# Altium project B302.PrjPcb (part 2 of 2)

## Sheet Sense 7 Signal Isolation.SchDoc: Signal 7 Isolator
size 292 x 193 mm; SheetNumber: 9; SheetTotal: 11
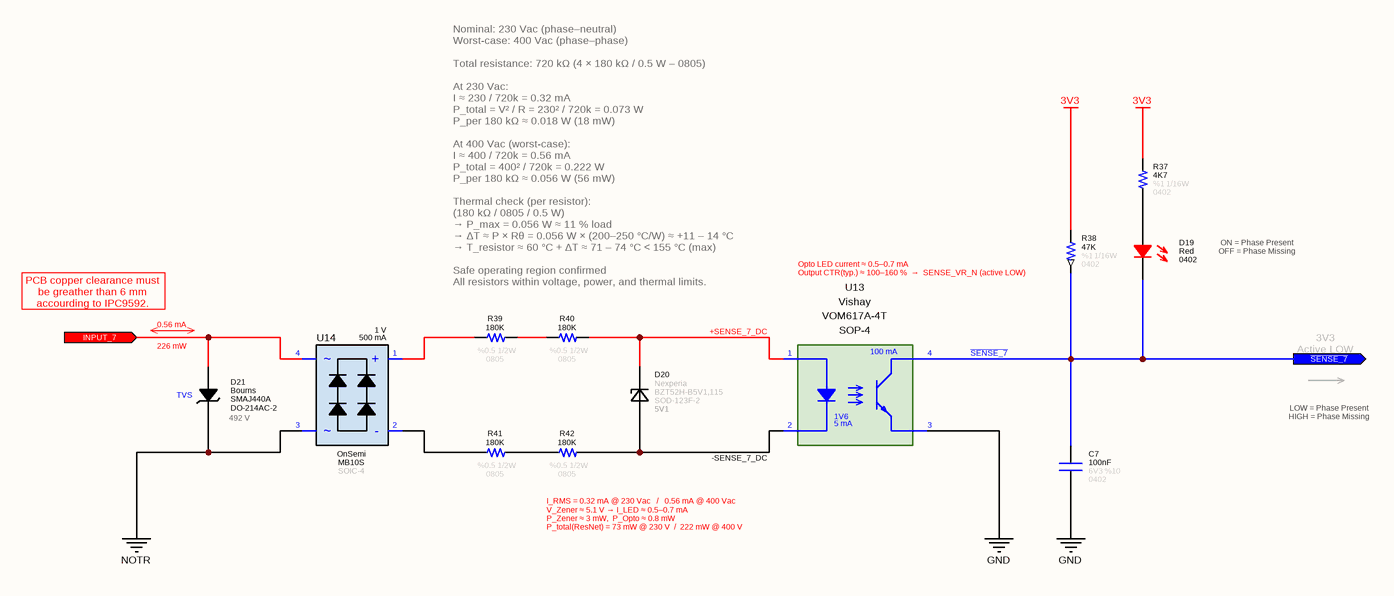
[diagram p8: Sense 7 Signal Isolation.SchDoc]

### Parts
C7  value 100nF  Tolerance: %10  Voltage: 6V3  Case: 0402  [CAPACITOR_0402]  (hidden comment: Capacitor - 100nF [0402] (MLCC))
D19  Case: 0402  Color: Red  [LED_0402]  (hidden comment: SMD LED (Red))
D20  Zener Voltage: 5V1  Manufacturer Name: Nexperia  [SOD-123F-2]  (hidden comment: BZT52H-B5V1,115)
D21  BreakDown Voltage: 492 V  Manufacturer Name: Bourns  Case: DO-214AC-2  [DO-220AA-2]  (hidden comment: SMAJ440A)
R37  value 4K7  Tolerance: %1  Case: 0402  Power: 1/16W  [RESISTOR_0402]  (hidden comment: 4K7 - 0402 - %1 - 1/16W)
R38  value 47K  Tolerance: %1  Case: 0402  Power: 1/16W  [RESISTOR_0402]  (hidden comment: 47K - 0402 - %1 - 1/16W)
R39  value 180K  Tolerance: %0.5  Case: 0805  Power: 1/2W  [RESISTOR_0805]  (hidden comment: 180K - 0805 - %0.5 - 1/2W)
R40  value 180K  Tolerance: %0.5  Case: 0805  Power: 1/2W  [RESISTOR_0805]  (hidden comment: 180K - 0805 - %0.5 - 1/2W)
R41  value 180K  Tolerance: %0.5  Case: 0805  Power: 1/2W  [RESISTOR_0805]  (hidden comment: 180K - 0805 - %0.5 - 1/2W)
R42  value 180K  Tolerance: %0.5  Case: 0805  Power: 1/2W  [RESISTOR_0805]  (hidden comment: 180K - 0805 - %0.5 - 1/2W)
U13  Manufacturer Name: Vishay  Case: SOP-4  If - Forward Current: 5 mA  Vf - Forward Voltage: 1V6  Maximum Collector Current: 100 mA  [SOP-4V2]  (hidden comment: VOM617A-4T)
U14  If - Forward Current: 500 mA  Vf - Forward Voltage: 1 V  Manufacturer Name: OnSemi  Manufacturer Part Number: MB10S  [SOIC-4]  (hidden comment: LTV-846S)

### Ports
INPUT_7 (in), ~{SENSE_7} (out)

### Nets
3V3: R37.2 R38.2
GND: C7.1 U13.3(Emiter)
NOTR: D21.2(Cathode) U14.3
+SENSE_7_DC: D20.1(Cathode) R40.1 U13.1(LED_Anode)
-SENSE_7_DC: D20.2(Anode) R42.1 U13.2(LED_Cathode)
~{SENSE_7}: C7.2 D19.1 R38.1 U13.4(Collector) ; port ~{SENSE_7}
NetD19_2: D19.2 R37.1
NetD21_1: D21.1(Anode) U14.4 ; port INPUT_7
NetR39_1: R39.1 R40.2
NetR39_2: R39.2 U14.1(+)
NetR41_1: R41.1 R42.2
NetR41_2: R41.2 U14.2(-)

### Notes on the sheet
- (near R38) Opto LED current ≈ 0.5–0.7 mA
  Output CTR(typ.) ≈ 100–160 %  →  SENSE_VR_N (active LOW)
- ON = Phase Present
  OFF = Phase Missing
- PCB copper clearance must be greather than 6 mm accourding to IPC9592.
- 0.56 mA
- (near D21) 226 mW
- Nominal: 230 Vac (phase–neutral)
  Worst-case: 400 Vac (phase–phase)
  Total resistance: 720 kΩ (4 × 180 kΩ / 0.5 W – 0805)
  At 230 Vac:
  I ≈ 230 / 720k = 0.32 mA
  P_total = V² / R = 230² / 720k = 0.073 W
  P_per 180 kΩ ≈ 0.018 W (18 mW)
  At 400 Vac (worst-case):
  I ≈ 400 / 720k = 0.56 mA
  P_total = 400² / 720k = 0.222 W
  P_per 180 kΩ ≈ 0.056 W (56 mW)
  Thermal check (per resistor):
  (180 kΩ / 0805 / 0.5 W)
  → P_max = 0.056 W ≈ 11 % load
  → ΔT ≈ P × Rθ = 0.056 W × (200–250 °C/W) ≈ +11 – 14 °C
  → T_resistor ≈ 60 °C + ΔT ≈ 71 – 74 °C < 155 °C (max)
  Safe operating region confirmed
  All resistors within voltage, power, and thermal limits.
- 3V3
  Active LOW
- LOW = Phase Present
  HIGH = Phase Missing
- I_RMS = 0.32 mA @ 230 Vac   /   0.56 mA @ 400 Vac
  V_Zener ≈ 5.1 V → I_LED ≈ 0.5–0.7 mA
  P_Zener ≈ 3 mW,  P_Opto ≈ 0.8 mW
  P_total(ResNet) = 73 mW @ 230 V  /  222 mW @ 400 V
- © 2021 All rights reserved.
  This document may not, in whole or in part, be copied, photocopied, reproduced, translated or converted to any electronic or machine readable from without prior written permission of Mehmet Günce Akkoyun.
  Engineer contact : akkoyun@me.com
- Property of
- Engineer :
- Date :
- Size :
- A4
- Time :
- Project :
- Page :
- /
- Customer :
- Product ID :
- Module ID :
- Version :
- File :
- Revision :
- (in symbol Diode - SMAJ440A (TVS)) TVS

### Library data of the parts
C7 = Capacitor - 100nF [0402-6V3]: Capacitor (MLCC) - 100nF / 6V3 / 0402; Manufacturer Name: KYOCERA AVX; Manufacturer Part Number: 04026D104KAT4A; ComponentLink1Description: Mouser; ComponentLink1URL: https://www.mouser.com.tr/ProductDetail/AVX/04026D104KAT4A?qs=sGAEpiMZZMs0AnBnWHyRQPg4iYkCw7IMED%2F4kpqgf7w%3D; ComponentLink2Description: DataSheet; ComponentLink2URL: https://www.mouser.com.tr/datasheet/2/40/cx5r-776519.pdf; Subcategory: Capacitors
D19 = Diode - LED (0402-Red): Standard LEDs - SMD MINI-MOLD ULTRA COMPACT RED; Manufacturer Name: ROHM Semiconductor; Manufacturer Part Number: SML-P12VTT86R; ROHS: Yes; ComponentLink1Description: DataSheet; ComponentLink1URL: https://www.mouser.com.tr/datasheet/2/348/sml-p1-e-1139198.pdf; ComponentLink2Description: Mouser; ComponentLink2URL: https://www.mouser.com.tr/ProductDetail/ROHM-Semiconductor/SML-P12U2TT86R?qs=sGAEpiMZZMseGfSY3csMkRIBDsfU3UCXJTULB5gem9Ta%252Bp%252BvZ709fg%3D%3D
D20 = Diode - BZT52H-B5V1,115: Zener Diodes BZT52H-B5V1/SOD123F/SOD2; Product Type: Zener Diodes; RoHS: Yes; Manufacturer Part Number: BZT52H-B5V1,115; Case: SOD-123F-2
D21 = Diode - SMAJ440A (TVS): ESD Protection Diodes / TVS Diodes 440volts 1uA .6 Amps Uni-Dir; Peak Pulse Current: 600 mA; Working Voltage: 440 V; Clamping Voltage: 713 V; Product Type: TVS Diodes; RoHS: Yes; Manufacturer Part Number: SMAJ440A
R37 = Resistor - 4K7 [0402]: Thick Film Resistors - SMD 1/16 W 4.7 KOhm 1%; Manufacturer Name: Vishay; Manufacturer Part Number: CRCW04024K70FKED; ComponentLink1Description: DataSheet; ComponentLink1URL: https://www.mouser.com.tr/datasheet/2/427/dcrcwe3-1762152.pdf; ComponentLink2Description: Mouser; ComponentLink2URL: https://www.mouser.com.tr/ProductDetail/Vishay-Dale/CRCW04024K70FKED?qs=sGAEpiMZZMu61qfTUdNhG7nHf%2F6MTUn3HadIdDQu24Q%3D
R38 = Resistor - 47K [0402]: Thick Film Resistors - SMD 1/16 W 47 KOhm 1%; Manufacturer Name: Vishay; Manufacturer Part Number: CRCW040247K0FKED; ComponentLink1Description: DataSheet; ComponentLink1URL: https://www.mouser.com.tr/datasheet/2/427/dcrcwe3-1762152.pdf; ComponentLink2Description: Mouser; ComponentLink2URL: https://www.mouser.com.tr/ProductDetail/Vishay-Dale/CRCW040247K0FKED?qs=sGAEpiMZZMu61qfTUdNhG2DpbjADlD3GL%252B3h1elTxqU%3D
R39-R42 = Resistor - 180K [0805]: Thick Film Resistors - SMD 0805 180Kohms 0.5W 0.5% AEC-Q200; Manufacturer Name: Panasonic; Manufacturer Part Number: ERJ-P06D1803V; ComponentLink1Description: DataSheet; ComponentLink1URL: https://www.mouser.com.tr/datasheet/2/427/dcrcwe3-1762152.pdf; ComponentLink2Description: Mouser; ComponentLink2URL: https://www.mouser.com.tr/ProductDetail/Vishay-Dale/CRCW040210K0FKED?qs=sGAEpiMZZMu61qfTUdNhG2DpbjADlD3GcalbOv9utCY%3D
U13 = IC - VOM617A: Transistor Output Optocouplers Phototransistor Out CTR 160-320% 5mA; RoHS: Yes; Product Type: Transistor Output Optocouplers; Manufacturer Part Number: VOM617A-4T
U14 = IC - MB10S: Transistor Output Optocouplers Optocplr Phototrans 4-Channel; Case: SOIC-4

## Sheet Sense 8 Signal Isolation.SchDoc: Signal 8 Isolator
size 292 x 193 mm; SheetNumber: 10; SheetTotal: 11
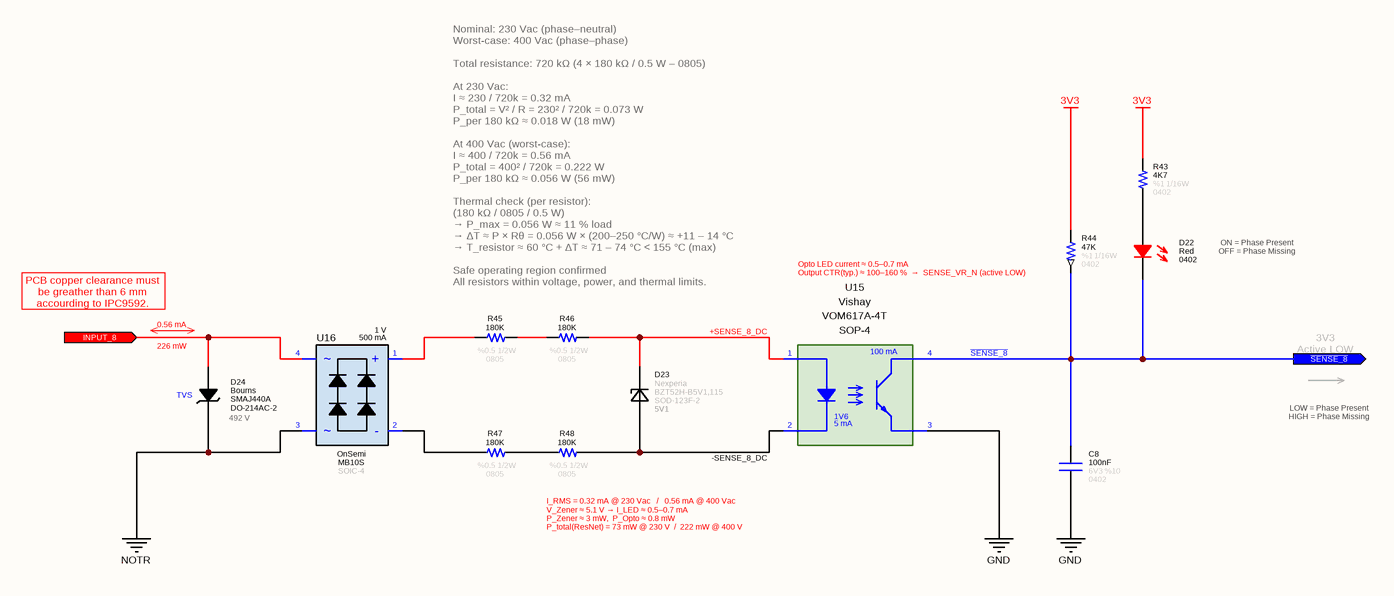
[diagram p9: Sense 8 Signal Isolation.SchDoc]

### Parts
C8  value 100nF  Tolerance: %10  Voltage: 6V3  Case: 0402  [CAPACITOR_0402]  (hidden comment: Capacitor - 100nF [0402] (MLCC))
D22  Case: 0402  Color: Red  [LED_0402]  (hidden comment: SMD LED (Red))
D23  Zener Voltage: 5V1  Manufacturer Name: Nexperia  [SOD-123F-2]  (hidden comment: BZT52H-B5V1,115)
D24  BreakDown Voltage: 492 V  Manufacturer Name: Bourns  Case: DO-214AC-2  [DO-220AA-2]  (hidden comment: SMAJ440A)
R43  value 4K7  Tolerance: %1  Case: 0402  Power: 1/16W  [RESISTOR_0402]  (hidden comment: 4K7 - 0402 - %1 - 1/16W)
R44  value 47K  Tolerance: %1  Case: 0402  Power: 1/16W  [RESISTOR_0402]  (hidden comment: 47K - 0402 - %1 - 1/16W)
R45  value 180K  Tolerance: %0.5  Case: 0805  Power: 1/2W  [RESISTOR_0805]  (hidden comment: 180K - 0805 - %0.5 - 1/2W)
R46  value 180K  Tolerance: %0.5  Case: 0805  Power: 1/2W  [RESISTOR_0805]  (hidden comment: 180K - 0805 - %0.5 - 1/2W)
R47  value 180K  Tolerance: %0.5  Case: 0805  Power: 1/2W  [RESISTOR_0805]  (hidden comment: 180K - 0805 - %0.5 - 1/2W)
R48  value 180K  Tolerance: %0.5  Case: 0805  Power: 1/2W  [RESISTOR_0805]  (hidden comment: 180K - 0805 - %0.5 - 1/2W)
U15  Manufacturer Name: Vishay  Case: SOP-4  If - Forward Current: 5 mA  Vf - Forward Voltage: 1V6  Maximum Collector Current: 100 mA  [SOP-4V2]  (hidden comment: VOM617A-4T)
U16  If - Forward Current: 500 mA  Vf - Forward Voltage: 1 V  Manufacturer Name: OnSemi  Manufacturer Part Number: MB10S  [SOIC-4]  (hidden comment: LTV-846S)

### Ports
INPUT_8 (in), ~{SENSE_8} (out)

### Nets
3V3: R43.2 R44.2
GND: C8.1 U15.3(Emiter)
NOTR: D24.2(Cathode) U16.3
+SENSE_8_DC: D23.1(Cathode) R46.1 U15.1(LED_Anode)
-SENSE_8_DC: D23.2(Anode) R48.1 U15.2(LED_Cathode)
~{SENSE_8}: C8.2 D22.1 R44.1 U15.4(Collector) ; port ~{SENSE_8}
NetD22_2: D22.2 R43.1
NetD24_1: D24.1(Anode) U16.4 ; port INPUT_8
NetR45_1: R45.1 R46.2
NetR45_2: R45.2 U16.1(+)
NetR47_1: R47.1 R48.2
NetR47_2: R47.2 U16.2(-)

### Notes on the sheet
- (near R44) Opto LED current ≈ 0.5–0.7 mA
  Output CTR(typ.) ≈ 100–160 %  →  SENSE_VR_N (active LOW)
- ON = Phase Present
  OFF = Phase Missing
- PCB copper clearance must be greather than 6 mm accourding to IPC9592.
- 0.56 mA
- (near D24) 226 mW
- Nominal: 230 Vac (phase–neutral)
  Worst-case: 400 Vac (phase–phase)
  Total resistance: 720 kΩ (4 × 180 kΩ / 0.5 W – 0805)
  At 230 Vac:
  I ≈ 230 / 720k = 0.32 mA
  P_total = V² / R = 230² / 720k = 0.073 W
  P_per 180 kΩ ≈ 0.018 W (18 mW)
  At 400 Vac (worst-case):
  I ≈ 400 / 720k = 0.56 mA
  P_total = 400² / 720k = 0.222 W
  P_per 180 kΩ ≈ 0.056 W (56 mW)
  Thermal check (per resistor):
  (180 kΩ / 0805 / 0.5 W)
  → P_max = 0.056 W ≈ 11 % load
  → ΔT ≈ P × Rθ = 0.056 W × (200–250 °C/W) ≈ +11 – 14 °C
  → T_resistor ≈ 60 °C + ΔT ≈ 71 – 74 °C < 155 °C (max)
  Safe operating region confirmed
  All resistors within voltage, power, and thermal limits.
- 3V3
  Active LOW
- LOW = Phase Present
  HIGH = Phase Missing
- I_RMS = 0.32 mA @ 230 Vac   /   0.56 mA @ 400 Vac
  V_Zener ≈ 5.1 V → I_LED ≈ 0.5–0.7 mA
  P_Zener ≈ 3 mW,  P_Opto ≈ 0.8 mW
  P_total(ResNet) = 73 mW @ 230 V  /  222 mW @ 400 V
- © 2021 All rights reserved.
  This document may not, in whole or in part, be copied, photocopied, reproduced, translated or converted to any electronic or machine readable from without prior written permission of Mehmet Günce Akkoyun.
  Engineer contact : akkoyun@me.com
- Property of
- Engineer :
- Date :
- Size :
- A4
- Time :
- Project :
- Page :
- /
- Customer :
- Product ID :
- Module ID :
- Version :
- File :
- Revision :
- (in symbol Diode - SMAJ440A (TVS)) TVS

### Library data of the parts
C8 = Capacitor - 100nF [0402-6V3]: as C7 on sheet Sense 7 Signal Isolation; ComponentLink1Description: Mouser; ComponentLink1URL: https://www.mouser.com.tr/ProductDetail/AVX/04026D104KAT4A?qs=sGAEpiMZZMs0AnBnWHyRQPg4iYkCw7IMED%2F4kpqgf7w%3D; ComponentLink2Description: DataSheet; ComponentLink2URL: https://www.mouser.com.tr/datasheet/2/40/cx5r-776519.pdf; Subcategory: Capacitors
D22 = Diode - LED (0402-Red): as D19 on sheet Sense 7 Signal Isolation; ROHS: Yes; ComponentLink1Description: DataSheet; ComponentLink1URL: https://www.mouser.com.tr/datasheet/2/348/sml-p1-e-1139198.pdf; ComponentLink2Description: Mouser; ComponentLink2URL: https://www.mouser.com.tr/ProductDetail/ROHM-Semiconductor/SML-P12U2TT86R?qs=sGAEpiMZZMseGfSY3csMkRIBDsfU3UCXJTULB5gem9Ta%252Bp%252BvZ709fg%3D%3D
D23 = Diode - BZT52H-B5V1,115: Zener Diodes BZT52H-B5V1/SOD123F/SOD2; Product Type: Zener Diodes; RoHS: Yes; Manufacturer Part Number: BZT52H-B5V1,115; Case: SOD-123F-2
D24 = Diode - SMAJ440A (TVS): as D21 on sheet Sense 7 Signal Isolation; Product Type: TVS Diodes; RoHS: Yes; Manufacturer Part Number: SMAJ440A
R43 = Resistor - 4K7 [0402]: as R37 on sheet Sense 7 Signal Isolation; ComponentLink1Description: DataSheet; ComponentLink1URL: https://www.mouser.com.tr/datasheet/2/427/dcrcwe3-1762152.pdf; ComponentLink2Description: Mouser; ComponentLink2URL: https://www.mouser.com.tr/ProductDetail/Vishay-Dale/CRCW04024K70FKED?qs=sGAEpiMZZMu61qfTUdNhG7nHf%2F6MTUn3HadIdDQu24Q%3D
R44 = Resistor - 47K [0402]: as R38 on sheet Sense 7 Signal Isolation; ComponentLink1Description: DataSheet; ComponentLink1URL: https://www.mouser.com.tr/datasheet/2/427/dcrcwe3-1762152.pdf; ComponentLink2Description: Mouser; ComponentLink2URL: https://www.mouser.com.tr/ProductDetail/Vishay-Dale/CRCW040247K0FKED?qs=sGAEpiMZZMu61qfTUdNhG2DpbjADlD3GL%252B3h1elTxqU%3D
R45-R48 = Resistor - 180K [0805]: as R39 on sheet Sense 7 Signal Isolation; ComponentLink1Description: DataSheet; ComponentLink1URL: https://www.mouser.com.tr/datasheet/2/427/dcrcwe3-1762152.pdf; ComponentLink2Description: Mouser; ComponentLink2URL: https://www.mouser.com.tr/ProductDetail/Vishay-Dale/CRCW040210K0FKED?qs=sGAEpiMZZMu61qfTUdNhG2DpbjADlD3GcalbOv9utCY%3D
U15 = IC - VOM617A: as U13 on sheet Sense 7 Signal Isolation; RoHS: Yes; Product Type: Transistor Output Optocouplers; Manufacturer Part Number: VOM617A-4T
U16 = IC - MB10S: as U14 on sheet Sense 7 Signal Isolation; Case: SOIC-4

## Sheet Input Connector.SchDoc: 220V (HV) Inpıt Connector
size 292 x 193 mm; SheetNumber: 11; SheetTotal: 11
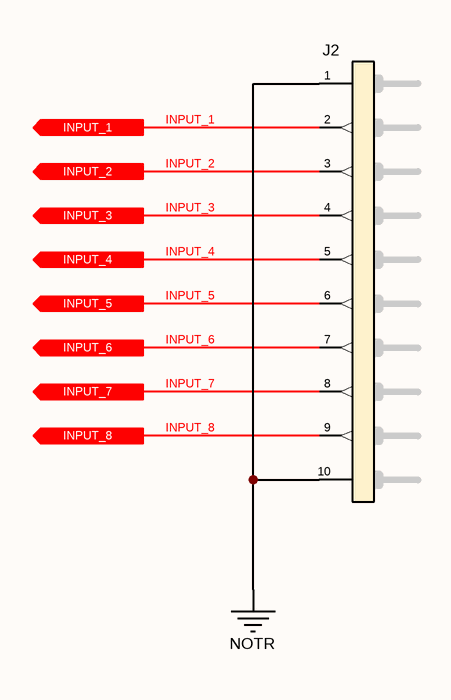
[diagram p10: Input Connector.SchDoc]

### Parts
J2  2.54 mm Pitch 8P Male Connector  [Pin Header 1x10 TH Pitch 2.54mm]  (value not drawn)

### Ports
INPUT_1 (out), INPUT_2 (out), INPUT_3 (out), INPUT_4 (out), INPUT_5 (out), INPUT_6 (out), INPUT_7 (out), INPUT_8 (out)

### Nets
NOTR: J2.1(Pin-1) J2.10(Pin-10)
INPUT_1: J2.2(Pin-2) ; port INPUT_1
INPUT_2: J2.3(Pin-3) ; port INPUT_2
INPUT_3: J2.4(Pin-4) ; port INPUT_3
INPUT_4: J2.5(Pin-5) ; port INPUT_4
INPUT_5: J2.6(Pin-6) ; port INPUT_5
INPUT_6: J2.7(Pin-7) ; port INPUT_6
INPUT_7: J2.8(Pin-8) ; port INPUT_7
INPUT_8: J2.9(Pin-9) ; port INPUT_8

### Notes on the sheet
- © 2021 All rights reserved.
  This document may not, in whole or in part, be copied, photocopied, reproduced, translated or converted to any electronic or machine readable from without prior written permission of Mehmet Günce Akkoyun.
  Engineer contact : akkoyun@me.com
- Property of
- Engineer :
- Date :
- Size :
- A4
- Time :
- Project :
- Page :
- /
- Customer :
- Product ID :
- Module ID :
- Version :
- File :
- Revision :

### Library data of the parts
J2 = Connector - Male Header 10P (2.54): Headers & Wire Housings BREAKAWAY HDR VERT 8; Manufacturer Name: Molex; Position: 10; Row: 1; Pitch: 2.54 mm; Manufacturer Part Number: 22-28-4103; ROHS: Yes

## Nets that join several sheets
3V3: Sense 1 Signal Isolation (R1.2 R2.2), Card Edge Connector (J1.7 J1.8), Sense 2 Signal Isolation (R7.2 R8.2), Sense 3 Signal Isolation (R13.2 R14.2), Sense 4 Signal Isolation (R19.2 R20.2), Sense 5 Signal Isolation (R25.2 R26.2), Sense 6 Signal Isolation (R31.2 R32.2), Sense 7 Signal Isolation (R37.2 R38.2), Sense 8 Signal Isolation (R43.2 R44.2)
GND: Sense 1 Signal Isolation (C1.1 U1.3), Card Edge Connector (12 pins), Sense 2 Signal Isolation (C2.1 U3.3), Sense 3 Signal Isolation (C3.1 U5.3), Sense 4 Signal Isolation (C4.1 U7.3), Sense 5 Signal Isolation (C5.1 U9.3), Sense 6 Signal Isolation (C6.1 U11.3), Sense 7 Signal Isolation (C7.1 U13.3), Sense 8 Signal Isolation (C8.1 U15.3)
NOTR: Sense 1 Signal Isolation (D3.2 U2.3), Sense 2 Signal Isolation (D6.2 U4.3), Sense 3 Signal Isolation (D9.2 U6.3), Sense 4 Signal Isolation (D12.2 U8.3), Sense 5 Signal Isolation (D15.2 U10.3), Sense 6 Signal Isolation (D18.2 U12.3), Sense 7 Signal Isolation (D21.2 U14.3), Sense 8 Signal Isolation (D24.2 U16.3), Input Connector (J2.1 J2.10)